# Altium schematic sheet PL_PHY_RJ45.SchDoc: Ethernet From Programmable Logic (PL) to PHY and RJ45
size A4; DocumentNumber: 11; SheetNumber: 11; SheetTotal: 16
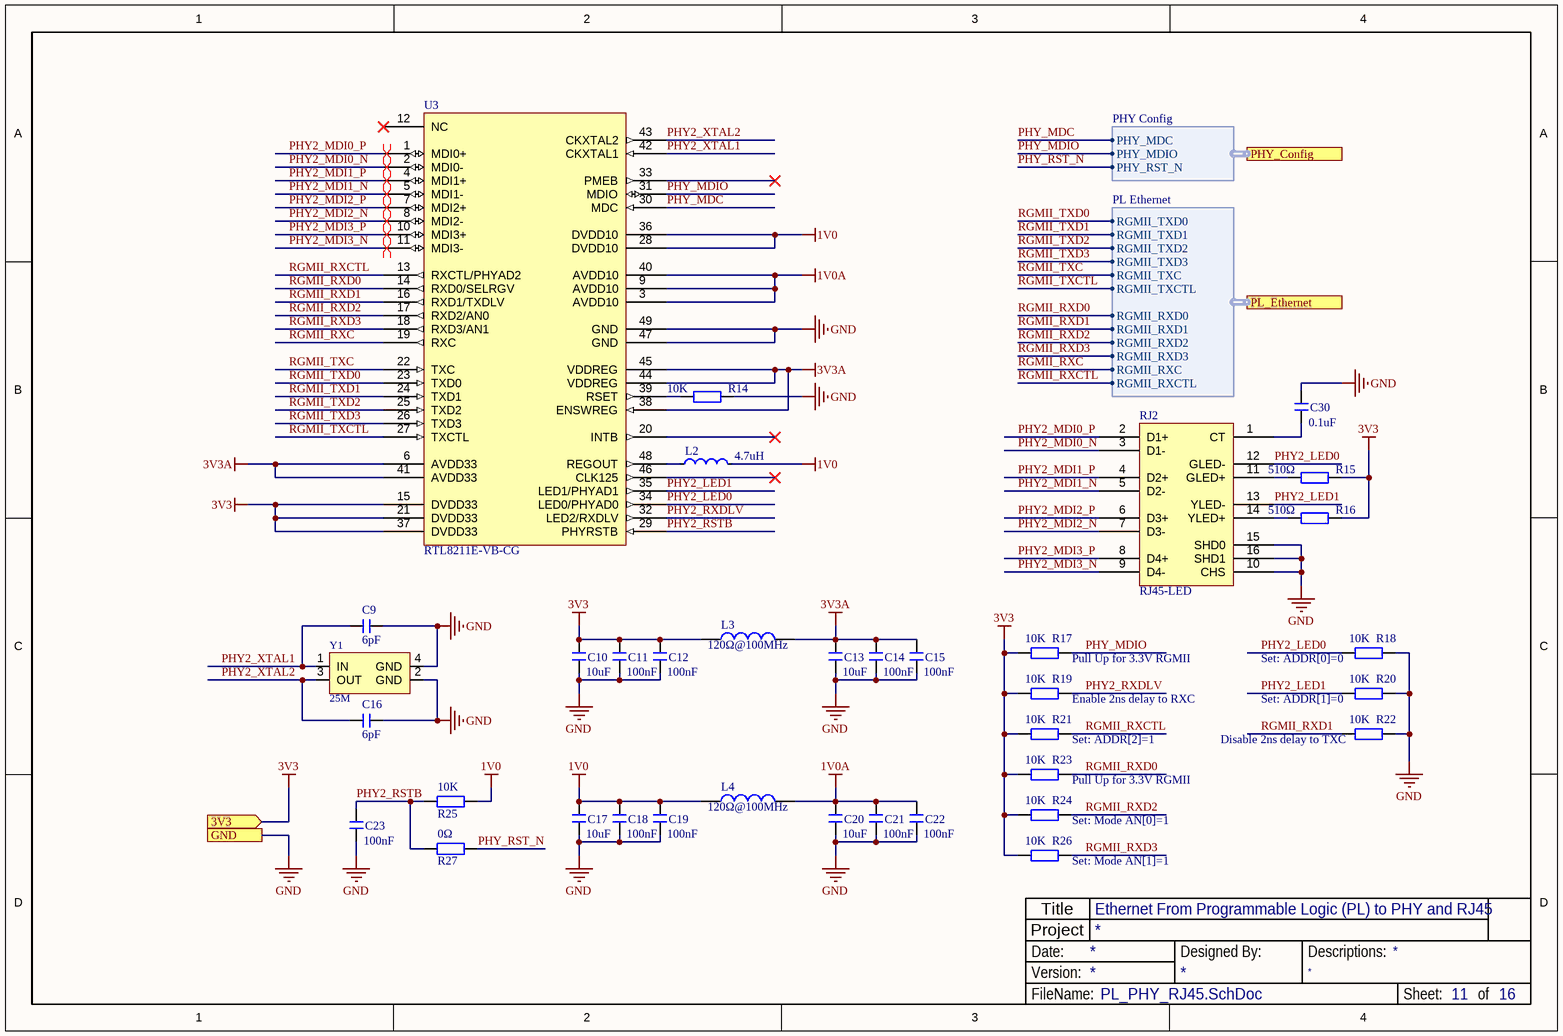
[diagram p0: PL_PHY_RJ45.SchDoc]

## Parts
C9  6pF  [C 0402_L]
C10  10uF  [C 0402_L]
C11  100nF  [C 0402_L]
C12  100nF  [C 0402_L]
C13  10uF  [C 0402_L]
C14  100nF  [C 0402_L]
C15  100nF  [C 0402_L]
C16  6pF  [C 0402_L]
C17  10uF  [C 0402_L]
C18  100nF  [C 0402_L]
C19  100nF  [C 0402_L]
C20  10uF  [C 0402_L]
C21  100nF  [C 0402_L]
C22  100nF  [C 0402_L]
C23  100nF  [C 0201_L]
C30  0.1uF  [C 0603_L]
L2  Inductance: 4.7uH  [IND-SMD_L7.6-W6.6]  (hidden comment: Inductance SMD)
L3  120Ω@100MHz  [L 0603]
L4  120Ω@100MHz  [L 0603]
R14  10K  [R 0402_L]
R15  510Ω  [R 0402_L]
R16  510Ω  [R 0402_L]
R17  10K  [R 0201_L]
R18  10K  [R 0201_L]
R19  10K  [R 0201_L]
R20  10K  [R 0201_L]
R21  10K  [R 0201_L]
R22  10K  [R 0201_L]
R23  10K  [R 0201_L]
R24  10K  [R 0201_L]
R25  10K  [R 0201_L]
R26  10K  [R 0201_L]
R27  0Ω  [R 0201_L]
RJ2  RJ45-LED  [RJ-45A16]
U3  RTL8211E-VB-CG  [QFN-48_L6.0-W6.0-P0.40]
Y1  25M  [XTAL-3225]

## Ports
3V3 (in), GND, PHY_Config (harness PHY Config), PL_Ethernet (harness PL Ethernet)

## Harnesses
PL Ethernet: RGMII_TXD0, RGMII_TXD1, RGMII_TXD2, RGMII_TXD3, RGMII_TXC, RGMII_TXCTL, RGMII_RXD0, RGMII_RXD1, RGMII_RXD2, RGMII_RXD3, RGMII_RXC, RGMII_RXCTL
PHY Config: PHY_MDC, PHY_MDIO, PHY_RST_N

## Nets
1V0: C17.2 C18.2 C19.2 L2.2 L4.1 R25.2 U3.28(DVDD10) U3.36(DVDD10)
1V0A: C20.2 C21.2 C22.2 L4.2 U3.3(AVDD10) U3.9(AVDD10) U3.40(AVDD10)
3V3: C10.2 C11.2 C12.2 L3.1 R15.2 R16.2 R17.1 R19.1 R21.1 R23.1 R24.1 R26.1 U3.15(DVDD33) U3.21(DVDD33) U3.37(DVDD33) ; port 3V3
3V3A: C13.2 C14.2 C15.2 L3.2 U3.6(AVDD33) U3.38(ENSWREG) U3.41(AVDD33) U3.44(VDDREG) U3.45(VDDREG)
GND: C9.2 C10.1 C11.1 C12.1 C13.1 C14.1 C15.1 C16.2 C17.1 C18.1 C19.1 C20.1 C21.1 C22.1 C23.1 C30.2 R14.2 R18.2 R20.2 R22.2 RJ2.10(CHS) RJ2.15(SHD0) RJ2.16(SHD1) U3.47(GND) U3.49(GND) Y1.2(GND) Y1.4(GND) ; port GND
PHY2_LED0: R18.1 RJ2.12(GLED-) U3.34(LED0/PHYAD0)
PHY2_LED1: R20.1 RJ2.13(YLED-) U3.35(LED1/PHYAD1)
PHY2_MDI0_N: RJ2.3(D1-) U3.2(MDI0-)
PHY2_MDI0_P: RJ2.2(D1+) U3.1(MDI0+)
PHY2_MDI1_N: RJ2.5(D2-) U3.5(MDI1-)
PHY2_MDI1_P: RJ2.4(D2+) U3.4(MDI1+)
PHY2_MDI2_N: RJ2.7(D3-) U3.8(MDI2-)
PHY2_MDI2_P: RJ2.6(D3+) U3.7(MDI2+)
PHY2_MDI3_N: RJ2.9(D4-) U3.11(MDI3-)
PHY2_MDI3_P: RJ2.8(D4+) U3.10(MDI3+)
PHY2_RSTB: C23.2 R25.1 R27.1 U3.29(PHYRSTB)
PHY2_RXDLV: R19.2 U3.32(LED2/RXDLV)
PHY2_XTAL1: C9.1 U3.42(CKXTAL1) Y1.1(IN)
PHY2_XTAL2: C16.1 U3.43(CKXTAL2) Y1.3(OUT)
PHY_MDC: U3.30(MDC) ; port PHY_Config.PHY_MDC
PHY_MDIO: R17.2 U3.31(MDIO) ; port PHY_Config.PHY_MDIO
PHY_RST_N: R27.2 ; port PHY_Config.PHY_RST_N
RGMII_RXC: U3.19(RXC) ; port PL_Ethernet.RGMII_RXC
RGMII_RXCTL: R21.2 U3.13(RXCTL/PHYAD2) ; port PL_Ethernet.RGMII_RXCTL
RGMII_RXD0: R23.2 U3.14(RXD0/SELRGV) ; port PL_Ethernet.RGMII_RXD0
RGMII_RXD1: R22.1 U3.16(RXD1/TXDLV) ; port PL_Ethernet.RGMII_RXD1
RGMII_RXD2: R24.2 U3.17(RXD2/AN0) ; port PL_Ethernet.RGMII_RXD2
RGMII_RXD3: R26.2 U3.18(RXD3/AN1) ; port PL_Ethernet.RGMII_RXD3
RGMII_TXC: U3.22(TXC) ; port PL_Ethernet.RGMII_TXC
RGMII_TXCTL: U3.27(TXCTL) ; port PL_Ethernet.RGMII_TXCTL
RGMII_TXD0: U3.23(TXD0) ; port PL_Ethernet.RGMII_TXD0
RGMII_TXD1: U3.24(TXD1) ; port PL_Ethernet.RGMII_TXD1
RGMII_TXD2: U3.25(TXD2) ; port PL_Ethernet.RGMII_TXD2
RGMII_TXD3: U3.26(TXD3) ; port PL_Ethernet.RGMII_TXD3
NetC30_1: C30.1 RJ2.1(CT)
NetL2_1: L2.1 U3.48(REGOUT)
NetR14_1: R14.1 U3.39(RSET)
NetR15_1: R15.1 RJ2.11(GLED+)
NetR16_1: R16.1 RJ2.14(YLED+)

Not connected (* = marked no-connect by the designer): U3 12(NC)* 20(INTB)* 33(PMEB)* 46(CLK125)*

## Layout directives
differential pair: PHY2_MDI0_N, PHY2_MDI0_P, PHY2_MDI1_N, PHY2_MDI1_P, PHY2_MDI2_N, PHY2_MDI2_P, PHY2_MDI3_N, PHY2_MDI3_P

## Notes on the sheet
- (near R17) Pull Up for 3.3V RGMII
- (near R19) Enable 2ns delay to RXC
- (near R18) Set: ADDR[0]=0
- (near R20) Set: ADDR[1]=0
- (near R21) Set: ADDR[2]=1
- (near R23) Pull Up for 3.3V RGMII
- (near R22) Disable 2ns delay to TXC
- (near R24) Set: Mode AN[0]=1
- (near R26) Set: Mode AN[1]=1
- Title
- FileName:
- Version:
- Date:
- Project
- Designed By:
- Descriptions:
- Sheet:
- of

## Library data of the parts
C9-C23 C30 = C: 贴片电容; BOM名称: 无极性贴片电容; 淘宝ID: 封装库来自淘宝 ID：黄晶宝石; 联系售后，技术支持: https://shop463601444.taobao.com; 唯一出售店铺网址: https://shop463601444.taobao.com
L2 = Inductance SMD: *LCID: C967698
L3 L4 = L: 小功率贴片电感; 淘宝ID: 封装库来自淘宝 ID：黄晶宝石; 封装库来自淘宝卖家 ID：黄晶宝石: 其他店铺购入均为盗版，不享受售后技术支持服务，请立即申请退款; BOM名称: 小功率贴片电感; 联系售后: https://shop463601444.taobao.com
R14-R27 = R: 贴片电阻; 版权归属: 来自淘宝 ID：黄晶宝石; 封装库来自淘宝卖家 ID：黄晶宝石: 其他店铺购入均为盗版，不享受售后技术支持服务，请立即申请退款; BOM名称: 贴片电阻; 联系售后: https://shop463601444.taobao.com
RJ2 = RJ45-2LED: 带灯以太网接口; 版权归属: 封装库来自淘宝 ID：黄晶宝石; BOM名称: 带灯以太网接口; 学习资源: https://shop463601444.taobao.com
U3 = RTL8211E-VB-CG: Ethernet RGMII PHY Chip / *LCID: C90735
Y1 = XTAL-4P: 4脚无源晶振; BOM名称: 4脚晶振; 版权归属: 源创客; 学习资源: www.ooocke.com